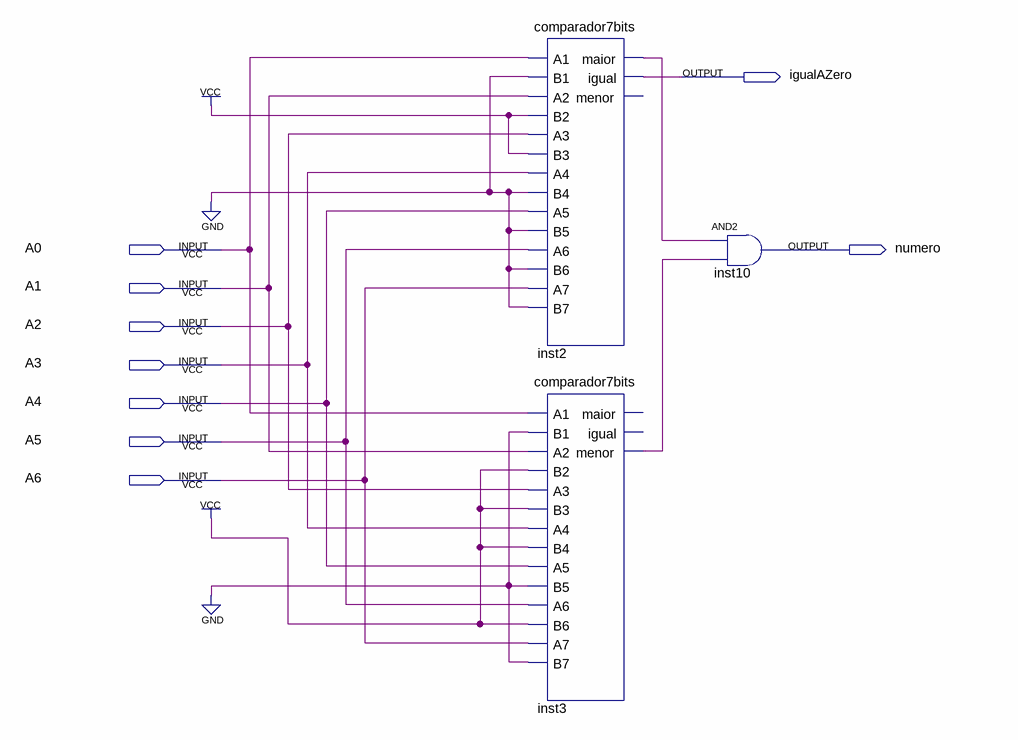
[diagram p0: schematic sheet]
// Quartus schematic tipoNumero.bdf as structural Verilog: 3 symbols, 9 pins
module tipoNumero (
  input  A0,
  input  A1,
  input  A2,
  input  A3,
  input  A4,
  input  A5,
  input  A6,
  output igualAZero,
  output numero
);

  wire inst2_maior, inst3_menor;

  comparador7bits inst2 (
    .A1(A0), .B1(1'b0), .A2(A1), .B2(1'b1), .A3(A2), .B3(1'b1), .A4(A3), .B4(1'b0), .A5(A4), .B5(1'b0),
    .A6(A5), .B6(1'b0), .A7(A6), .B7(1'b0), .maior(inst2_maior), .igual(igualAZero));  // open: menor
  comparador7bits inst3 (
    .A1(A0), .B1(1'b0), .A2(A1), .B2(1'b1), .A3(A2), .B3(1'b1), .A4(A3), .B4(1'b1), .A5(A4), .B5(1'b0),
    .A6(A5), .B6(1'b1), .A7(A6), .B7(1'b0), .menor(inst3_menor));  // open: maior, igual
  and inst10 (numero, inst2_maior, inst3_menor);
endmodule
